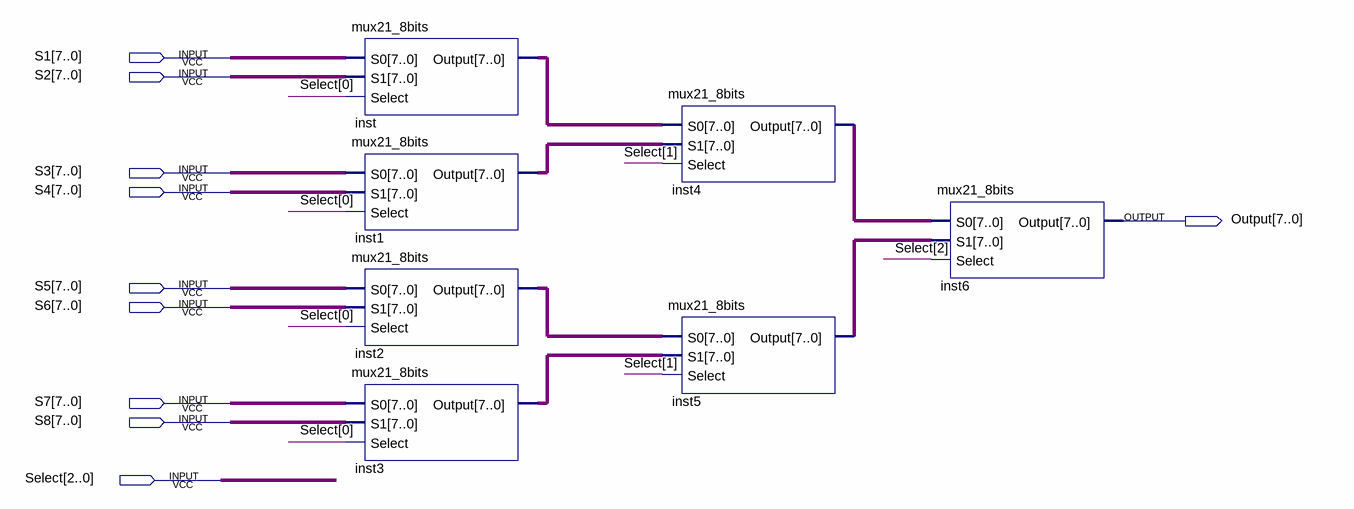
[diagram p0: schematic sheet]
// Quartus schematic Selector8to1.bdf as structural Verilog: 7 symbols, 10 pins
module Selector8to1 (
  input  [7:0] S1,
  input  [7:0] S2,
  input  [7:0] S3,
  input  [7:0] S4,
  input  [7:0] S5,
  input  [7:0] S6,
  input  [7:0] S7,
  input  [7:0] S8,
  input  [2:0] Select,
  output [7:0] Output
);

  wire [7:0] inst1_output, inst2_output, inst3_output, inst4_output, inst5_output, inst_output;

  mux21_8bits inst (.S0(S1), .S1(S2), .Select(Select[0]), .Output(inst_output));
  mux21_8bits inst1 (.S0(S3), .S1(S4), .Select(Select[0]), .Output(inst1_output));
  mux21_8bits inst2 (.S0(S5), .S1(S6), .Select(Select[0]), .Output(inst2_output));
  mux21_8bits inst3 (.S0(S7), .S1(S8), .Select(Select[0]), .Output(inst3_output));
  mux21_8bits inst4 (.S0(inst_output), .S1(inst1_output), .Select(Select[1]), .Output(inst4_output));
  mux21_8bits inst5 (.S0(inst2_output), .S1(inst3_output), .Select(Select[1]), .Output(inst5_output));
  mux21_8bits inst6 (.S0(inst4_output), .S1(inst5_output), .Select(Select[2]), .Output(Output));
endmodule
